# EAGLE design solar-radio (EAGLE 7.5.0)
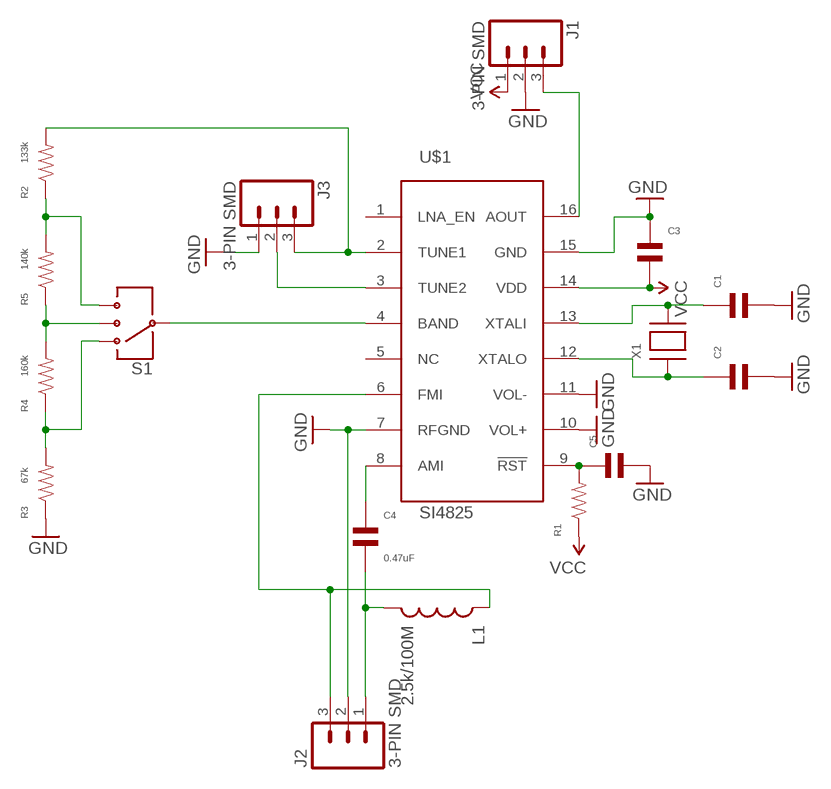
[diagram p0: schematic, sheet 1]

## Parts
C1  CAPACITOR_NP_0805  [C0805]
C2  CAPACITOR_NP_0805  [C0805]
C3  CAPACITOR_NP_0805  [C0805]
C4  0.47uF  CAPACITOR_NP_0805  [C0805]
C5  CAPACITOR_NP_0805  [C0805]
J1  3-PIN SMD  M03JST-SMD  [JST-3-SMD]
J2  3-PIN SMD  M03JST-SMD  [JST-3-SMD]
J3  3-PIN SMD  M03JST-SMD  [JST-3-SMD]
L1  2.5k/100M  INDUCTOR0805  [0805]
R1  RESISTOR_0805  [R0805]
R2  133k  RESISTOR_0805  [R0805]
R3  67k  RESISTOR_0805  [R0805]
R4  160k  RESISTOR_0805  [R0805]
R5  140k  RESISTOR_0805  [R0805]
S1  SWITCH-SP3T  [SWITCH-SP3T-SMD]
U$1  SI4825  [SOIC16N]
X1  XTAL-3.2X1.5  [XTAL3215]

## Nets
GND: C1.P$2 C2.P$2 C3.P$1 C5.P$2 J1.2 J2.2 J3.1 R3.P$1 U$1.7(RFGND) U$1.10(VOL+) U$1.11(VOL-) U$1.15(GND)
N$1: J3.2 U$1.3(TUNE2)
N$2: J3.3 R2.P$2 U$1.2(TUNE1)
N$3: R2.P$1 R5.P$2 S1.4
N$4: R4.P$2 R5.P$1 S1.2
N$5: R3.P$2 R4.P$1 S1.1
N$6: S1.3 U$1.4(BAND)
N$7: C4.P$1 U$1.8(AMI)
N$8: C4.P$2 J2.1 L1.2
N$9: J2.3 L1.1 U$1.6(FMI)
N$10: C5.P$1 R1.P$2 U$1.9(!RST)
N$11: C1.P$1 U$1.13(XTALI) X1.P$2
N$12: C2.P$1 U$1.12(XTALO) X1.P$1
N$13: J1.3 U$1.16(AOUT)
VCC: C3.P$2 J1.1 R1.P$1 U$1.14(VDD)
Unconnected: U$1.1(LNA_EN) U$1.5(NC)

## Library data of the parts
C1-C5 = MF_Passives:CAPACITOR_NP: Library: MF_Passives Description: Device for Non-Polarized Capacitors. Manufacture part number (MFG#), Voltage, Temperature Coefficient, and Tolerance can be added via Attributes.; MFG#: N/A; TEMP_COF: N/A; TOLERANCE: N/A; VOLTAGE: N/A
J1-J3 = SparkFun-Connectors:M03: Header 3 Standard 3-pin 0.1" header. Use with straight break away headers (SKU : PRT-00116), right angle break away headers (PRT-00553), swiss pins (PRT-00743), machine pins (PRT-00117), and female headers (PRT-00115). Molex polarized connector foot print use with SKU : PRT-08232 with associated crimp pins and housings.; PROD_ID: CONN-12591
L1 = SparkFun-Passives:INDUCTOR: Inductors Basic Inductor/Choke - 0603 and 1206. Footprints are not proven and vary greatly between part numbers. INDUCTOR POWER 3.3UH 4.0A SMD 0.197" L x 0.197" W x 0.177" H (5.00mm x 5.00mm x 4.50mm)
R1-R5 = MF_Passives:RESISTOR: Library: MF_Passives Description: Device for Resistors. Manufacture part number (MFG#), Voltage, Tolerance, and Wattage Rating can be added via Attributes.; MFG#: N/A; TOLERANCE: N/A; VOLTAGE: N/A; WATTAGE: N/A
S1 = SparkFun-Electromechanical:SWITCH-SP3T
U$1 = sonik:SI4825
X1 = adafruit:XTAL: Low cost SMT crystals, no capacitors included http://www.ladyada.net/library/eagle

## Board
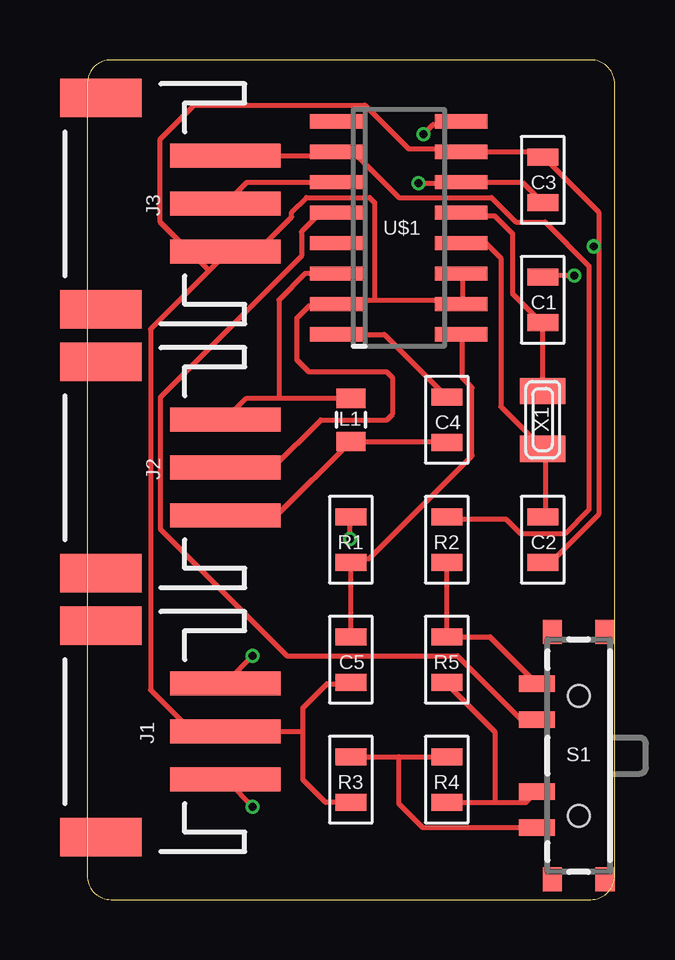
[diagram p1: board, top side]
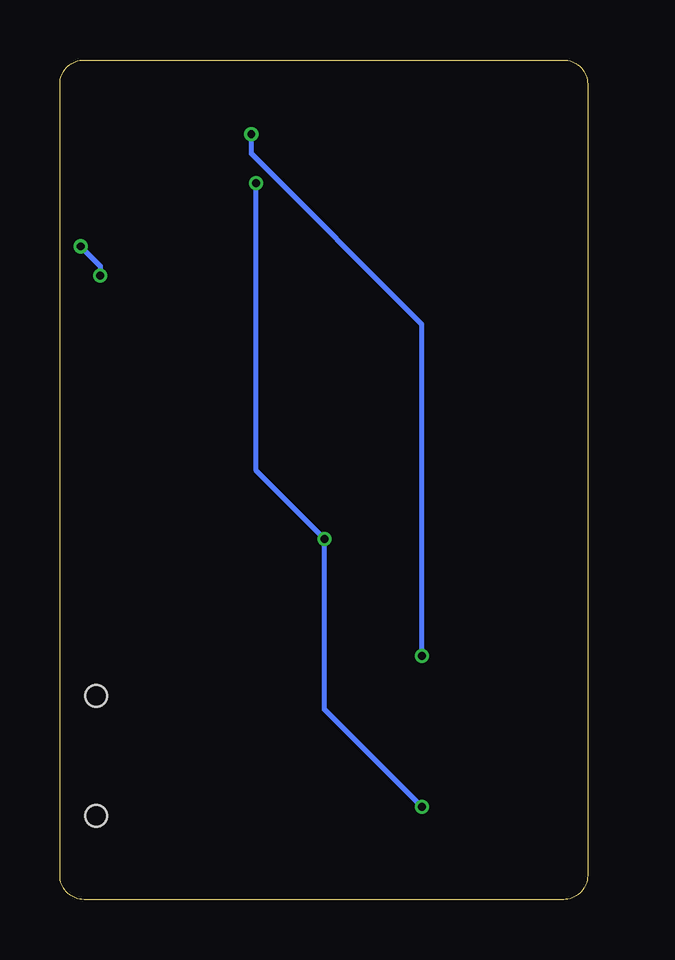
[diagram p2: board, bottom side, seen from below]

Size 22 x 35 mm. Coordinates in mm from the lower left corner, seen from the top.
Outline: 21,35 1,35 arc90 0,34 0,1 arc90 1,0 21,0 arc90 22,1 22,34 arc90 21,35
Copper layers (1*16): Top 0.0356mm / dielectric 1.5011mm / Bottom 0.0356mm
Design rules "OSHparkDruTented8mil": minimum track width 8mil, minimum drill 13mil, track to track 8mil, track to pad 8mil, pad to pad 8mil, via to via 8mil, smd to smd 5mil, copper to edge 15mil, drill to drill 6mil, minimum pad ring 5mil, minimum via ring 5mil, stop-mask expansion 3mil, vias tented up to drill 14mil, thermal gap 10mil

### Footprints (pad centres in the part's own frame; a part is rotated, then mirrored left to right if it is on the bottom)
C0805 = smd 0.7 x 1.3: P$1 -0.95,0; P$2 0.95,0
JST-3-SMD = smd 1 x 4.6: 1 -1.99,-4.77; 2 0.01,-4.77; 3 2.01,-4.77 | smd 1.6 x 3.4: NC1 -4.39,0.43; NC2 4.41,0.43
0805 = smd 0.8 x 1.2: 1 -0.9,0; 2 0.9,0
R0805 = smd 0.7 x 1.3: P$1 -0.95,0; P$2 0.95,0
SWITCH-SP3T-SMD = smd 0.7 x 1.5: 1 3,-1.75; 2 1.5,-1.75; 3 -1.5,-1.75; 4 -3,-1.75 | smd 1 x 0.8: P$1 -5.15,-1.1; P$2 -5.15,1.1; P$3 5.15,1.1; P$4 5.15,-1.1 | hole 0.9: 2.5,0; -2.5,0
SOIC16N = smd 0.6 x 2.2: 1 -4.445,-2.6; 2 -3.175,-2.6; 3 -1.905,-2.6; 4 -0.635,-2.6; 5 0.635,-2.6; 6 1.905,-2.6; 7 3.175,-2.6; 8 4.445,-2.6; 9 4.445,2.6; 10 3.175,2.6; 11 1.905,2.6; 12 0.635,2.6; 13 -0.635,2.6; 14 -1.905,2.6; 15 -3.175,2.6; 16 -4.445,2.6
XTAL3215 = smd 1.1 x 1.9: P$1 1.2,0; P$2 -1.2,0

### Placement (x,y rotation side)
C1  19,25 90 top
C2  19,15 270 top
C3  19,30 270 top
C4  15,20 270 top
C5  11,10 270 top
J1  1,7 90 top
J2  1,18 90 top
J3  1,29 90 top
L1  11,20 270 top
R1  11,15 270 top
R2  15,15 90 top
R3  11,5 90 top
R4  15,5 270 top
R5  15,10 90 top
S1  20.5,6 270 top
U$1  13,28 270 top
X1  19,20 270 top

### Tracks (layer width: path | path; a pad name or v marks a point on that pad's centre or on a via)
GND  (via drill 0.33)
  Top 0.203: J2.2 7.76,18.01 9.75,20 12.5,20 12.75,20.25 12.75,21.75 12.5,22 9.25,22 8.75,22.5 8.75,24.25 9.25,24.75 10.32,24.75 U$1.7 10.57,24.99 11.99,24.99 | R3.P$1 9.95,4.05 9,5 9,7 | 9,7 J1.2 5.69,7.11 4.27,7.11 2.64,8.74 2.64,23.77 5.08,26.21 | 9,7 9,8 10,9 10.95,9 C5.P$2 | 21.34,27.23 21.34,28.65 19.1,30.89 C3.P$1 18.77,31.18 U$1.15 15.44,31.29 13.41,31.29 11.58,33.12 4.47,33.12 3.05,31.7 3.05,28.25 5.08,26.21 | 21.34,27.23 21.34,16.05 19.51,14.22 19.1,14.22 C2.P$2 | v20.32,26.01 19.1,26.01 C1.P$2 | 21.34,27.23 v21.13,27.23 | U$1.11 15.65,26.01 15.65,24.99 U$1.10 15.44,24.99 11.99,24.99 | 11.99,24.99 11.99,29.06 11.79,29.26 9.14,29.26 8.53,28.65 8.53,28.45 7.11,27.03 5.89,27.03 J3.1 5.69,26.82 5.08,26.21
  Bottom 0.203: v20.32,26.01 20.32,26.42 v21.13,27.23
N$1
  Top 0.203: J3.2 6.67,29.91 U$1.3
N$2
  Top 0.203: J3.3 10.23,31.01 U$1.2 10.57,31.09 11.18,31.09 13.01,29.26 16.87,29.26 17.88,28.25 19.1,28.25 20.93,26.42 20.93,16.26 19.91,15.24 18.09,15.24 17.48,15.85 15.04,15.85 R2.P$2
N$3
  Top 0.203: S1.4 16.8,10.95 R5.P$2 R2.P$1
N$4
  Top 0.203: R4.P$2 17,4.05 | 17,4.05 18.3,4.05 S1.2 | R5.P$1 15,9 17,7 17,4.05
N$5
  Top 0.203: R3.P$2 13,5.95 | 13,5.95 R4.P$1 | S1.1 14,3 13,4 13,5.95
N$6
  Top 0.203: S1.3 18.69,7.52 18.09,7.52 15.44,10.16 8.33,10.16 3.05,15.44 3.05,20.93 8.94,26.82 8.94,27.84 9.55,28.45 10.36,28.45 U$1.4
N$7
  Top 0.203: U$1.8 12.39,23.55 C4.P$1
N$8
  Top 0.203: C4.P$2 15,19 14.9,19.1 L1.2 7.91,16.01 J2.1
N$9
  Top 0.203: J2.3 6.66,20.9 8,20.9 | 8,20.9 L1.1 | U$1.6 9.1,26.09 8,25 8,20.9
N$10
  Top 0.203: C5.P$1 R1.P$2 11.18,14.22 11.79,14.22 16.05,18.49 16.05,21.34 15.65,21.74 15.65,23.37 U$1.9
N$11
  Top 0.203: U$1.13 15.73,28.5 17,28.5 17.75,27.75 17.75,25.25 18.95,24.05 C1.P$1 X1.P$2
N$12
  Top 0.203: U$1.12 16.64,27.36 17.25,26.75 17.25,20.55 X1.P$1 19.1,18.69 19.1,16.05 C2.P$1
N$13  (via drill 0.33)
  Top 0.203: v14.02,31.9 14.43,32.31 15.44,32.31 U$1.16 | v6.91,10.16 5.89,9.14 J1.3
  Bottom 0.203: v14.02,31.9 14.02,31.09 6.91,23.98 v6.91,10.16
VCC  (via drill 0.33)
  Top 0.203: C3.P$2 18.14,29.91 U$1.14 15.44,29.87 v13.82,29.87 | v10.97,15.04 10.97,15.85 R1.P$1 | v6.91,3.86 5.89,4.88 J1.1
  Bottom 0.203: v6.91,3.86 10.97,7.92 v10.97,15.04 13.82,17.88 v13.82,29.87